# Altium project EVACC_v3_1.PrjPCB
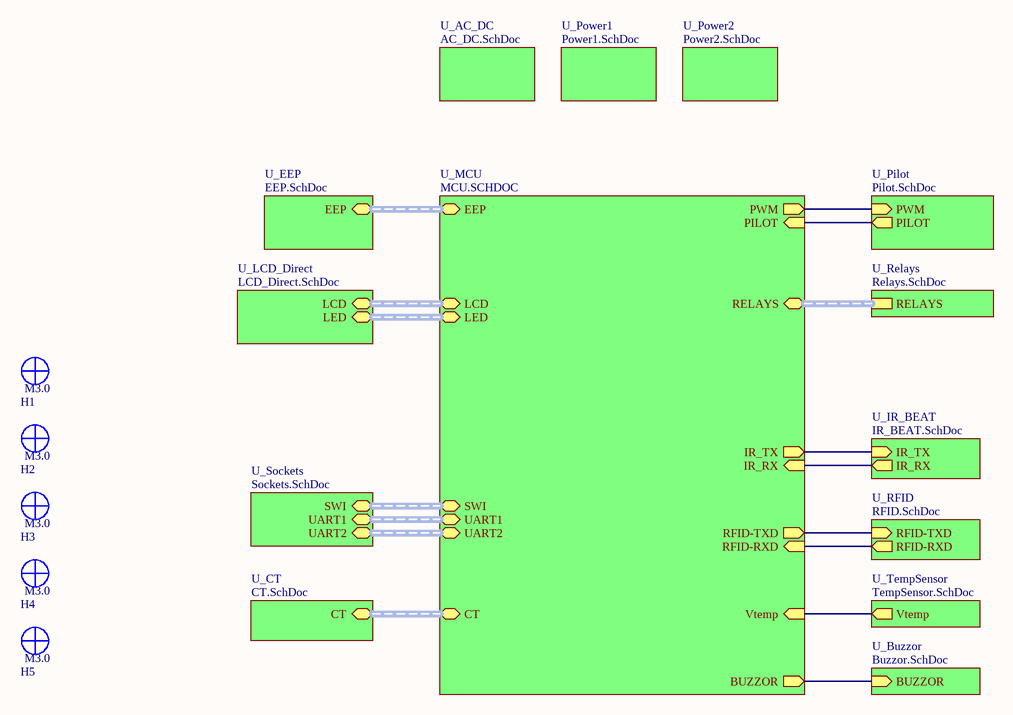
[diagram p0: layout.SchDoc]
15 sheets, 230 parts. Net scope: hierarchical (ports join the sheet entries above them; power ports are global).
Board file: evacc_v3_1.PcbDoc
Sheets:
  layout.SchDoc
    U_MCU = MCU.SCHDOC
    U_Pilot = Pilot.SchDoc
    U_EEP = EEP.SchDoc
    U_Sockets = Sockets.SchDoc
    U_TempSensor = TempSensor.SchDoc
    U_IR_BEAT = IR_BEAT.SchDoc
    U_RFID = RFID.SchDoc
    U_Buzzor = Buzzor.SchDoc
    U_CT = CT.SchDoc
    U_LCD_Direct = LCD_Direct.SchDoc
    U_Power1 = Power1.SchDoc
    U_Power2 = Power2.SchDoc
    U_AC_DC = AC_DC.SchDoc
    U_Relays = Relays.SchDoc

## Sheet layout.SchDoc
size A4

### Parts
H1  M3.0  [SCREW_HOLE_3.5]  (value not drawn)  (no BOM)
H2  M3.0  [SCREW_HOLE_3.5]  (value not drawn)  (no BOM)
H3  M3.0  [SCREW_HOLE_3.5]  (value not drawn)  (no BOM)
H4  M3.0  [SCREW_HOLE_3.5]  (value not drawn)  (no BOM)
H5  M3.0  [SCREW_HOLE_3.5]  (value not drawn)  (no BOM)

### Sub-sheets
U_AC_DC = AC_DC.SchDoc: no entries
U_Buzzor = Buzzor.SchDoc: BUZZOR (in)
U_CT = CT.SchDoc: CT (harness CT)
U_EEP = EEP.SchDoc: EEP (harness EEP)
U_IR_BEAT = IR_BEAT.SchDoc: IR_RX (out), IR_TX (in)
U_LCD_Direct = LCD_Direct.SchDoc: LCD (harness LCD), LED (harness LED)
U_MCU = MCU.SCHDOC: PWM (out), PILOT (in), Vtemp (in), IR_TX (out), RFID-TXD (out), IR_RX (in), RFID-RXD (in), BUZZOR (out), SWI (harness SWI), LCD (harness LCD), LED (harness LED), EEP (harness EEP), RELAYS (harness RELAYS), CT (harness CT), UART2 (harness UART2), UART1 (harness UART1)
U_Pilot = Pilot.SchDoc: PWM (in), PILOT (out)
U_Power1 = Power1.SchDoc: no entries
U_Power2 = Power2.SchDoc: no entries
U_Relays = Relays.SchDoc: RELAYS (harness RELAYS)
U_RFID = RFID.SchDoc: RFID-TXD (in), RFID-RXD (out)
U_Sockets = Sockets.SchDoc: SWI (harness SWI), UART2 (harness UART2), UART1 (harness UART1)
U_TempSensor = TempSensor.SchDoc: Vtemp (out)

### Nets
PILOT: sheet U_MCU/PILOT, sheet U_Pilot/PILOT
NetIR_PULSE_1: sheet U_MCU/IR_RX, sheet U_IR_BEAT/IR_RX
NetPWM_1: sheet U_MCU/PWM, sheet U_Pilot/PWM
NetR5_1: sheet U_MCU/RFID-TXD, sheet U_RFID/RFID-TXD
NetR36_1: sheet U_MCU/IR_TX, sheet U_IR_BEAT/IR_TX
NetR39_1: sheet U_MCU/Vtemp, sheet U_TempSensor/Vtemp
NetR40_2: sheet U_MCU/BUZZOR, sheet U_Buzzor/BUZZOR
NetU2_17: sheet U_MCU/RFID-RXD, sheet U_RFID/RFID-RXD

### Buses and harness runs
harness sheet U_CT/CT = sheet U_MCU/CT
harness sheet U_EEP/EEP = sheet U_MCU/EEP
harness sheet U_LCD_Direct/LCD = sheet U_MCU/LCD
harness sheet U_LCD_Direct/LED = sheet U_MCU/LED
harness sheet U_MCU/RELAYS = sheet U_Relays/RELAYS
harness sheet U_MCU/SWI = sheet U_Sockets/SWI
harness sheet U_MCU/UART1 = sheet U_Sockets/UART1
harness sheet U_MCU/UART2 = sheet U_Sockets/UART2

### Library data of the parts
H1-H5 = SCRE_HOLE_3.2: Screw hole for M3.0

## Sheet MCU.SCHDOC
size A4; SheetNumber: 2; SheetTotal: 6
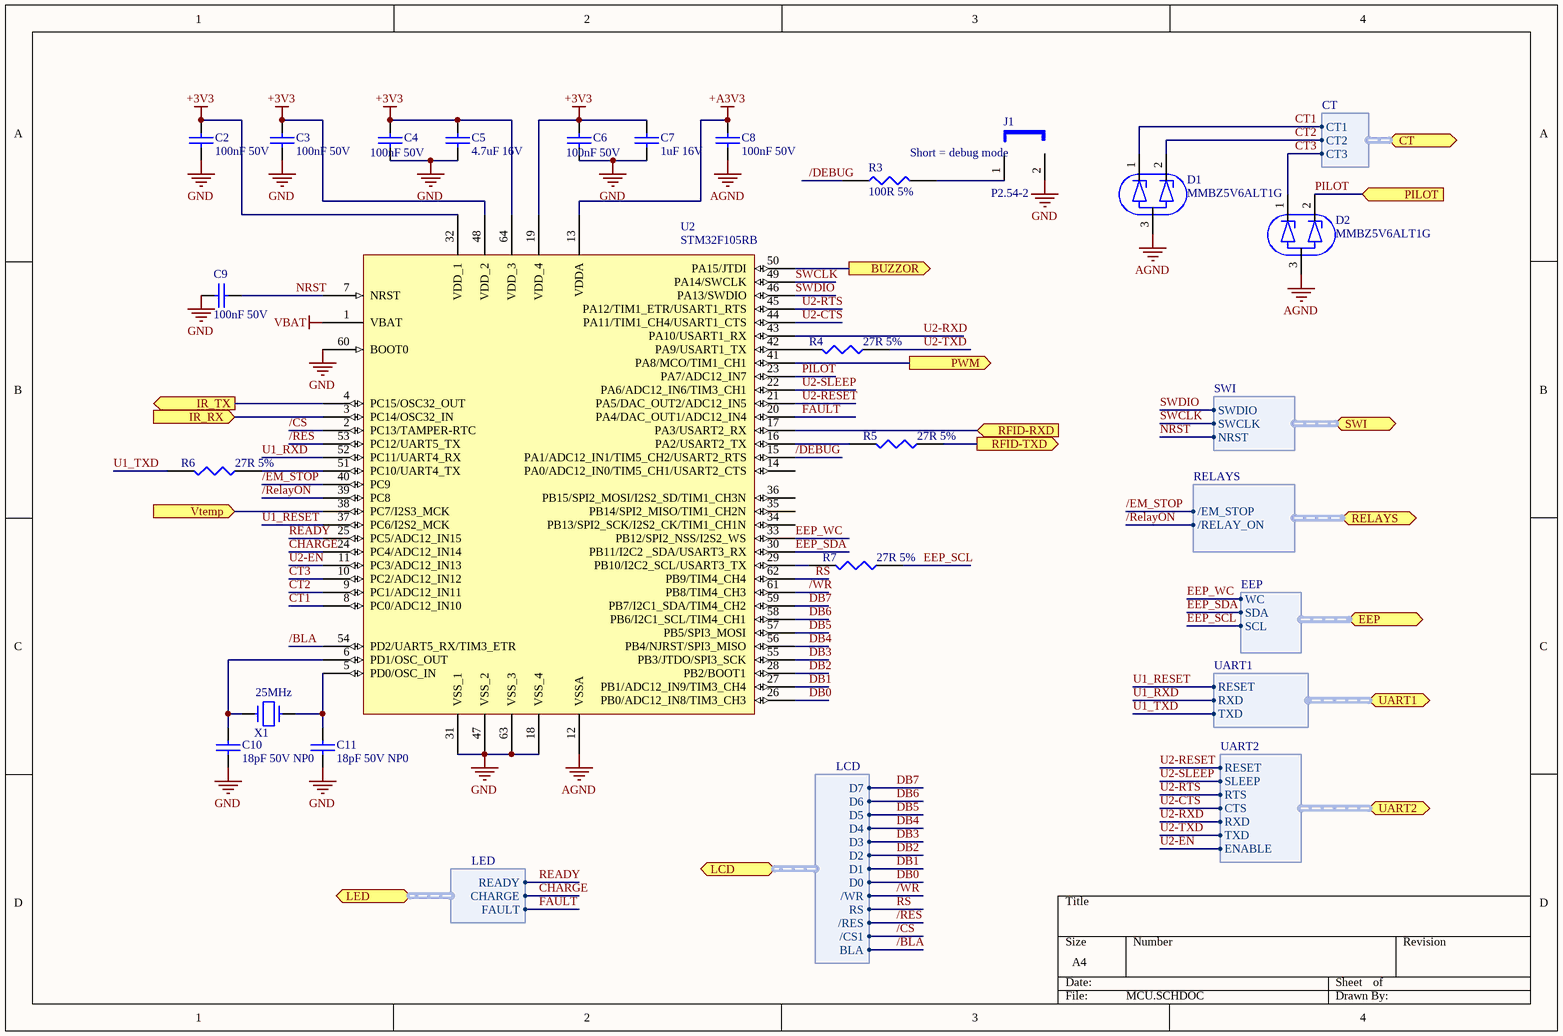
[diagram p1: MCU.SCHDOC]

### Parts
C2  100nF 50V  [CAPC2012N]
C3  100nF 50V  [CAPC2012N]
C4  100nF 50V  [CAPC2012N]
C5  4.7uF 16V  [CAPC2012N]
C6  100nF 50V  [CAPC2012N]
C7  1uF 16V  [CAPC2012N]
C8  100nF 50V  [CAPC2012N]
C9  100nF 50V  [CAPC2012N]
C10  18pF 50V NP0  [CAPC2012N]
C11  18pF 50V NP0  [CAPC2012N]
D1  MMBZ5V6ALT1G  [SOT23-3N]
D2  MMBZ5V6ALT1G  [SOT23-3N]
J1  P2.54-2  [JP2-P2.54]
R3  100R 5%  [RESC2012N]
R4  27R 5%  [RESC2012N]
R5  27R 5%  [RESC2012N]
R6  27R 5%  [RESC2012N]
R7  27R 5%  [RESC2012N]
U2  STM32F105RB  [TQFP64_M]
X1  25MHz  [ATSM-49]

### Ports
BUZZOR (out), CT (harness CT), EEP (harness EEP), IR_RX (in), IR_TX (out), LCD (harness LCD), LED (harness LED), PILOT (in), PWM (out), RELAYS (harness RELAYS), RFID-RXD (in), RFID-TXD (out), SWI (harness SWI), UART1 (harness UART1), UART2 (harness UART2), Vtemp (in)

### Harnesses
SWI: SWDIO, SWCLK, NRST
UART2: ENABLE, TXD, RXD, CTS, RTS, SLEEP, RESET
RELAYS: /EM_STOP, /RELAY_ON
LCD: D7, D6, D5, D4, D3, D2, D1, D0, /WR, RS, /RES, /CS1, BLA
LED: READY, CHARGE, FAULT
EEP: WC, SDA, SCL
CT: CT1, CT2, CT3
UART1: TXD, RXD, RESET

### Nets
+3V3: C2.1 C3.1 C4.1 C5.1 C6.1 C7.1 U2.19(VDD_4) U2.32(VDD_1) U2.48(VDD_2) U2.64(VDD_3)
+A3V3: C8.1 U2.13(VDDA)
AGND: C8.2 D1.3 D2.3 U2.12(VSSA)
GND: C2.2 C3.2 C4.2 C5.2 C6.2 C7.2 C9.2 C10.1 C11.1 J1.2 U2.18(VSS_4) U2.31(VSS_1) U2.47(VSS_2) U2.60(BOOT0) U2.63(VSS_3)
VBAT: U2.1(VBAT)
/BLA: U2.54(PD2/UART5_RX/TIM3_ETR) ; port LCD.BLA
/CS: U2.2(PC13/TAMPER-RTC) ; port LCD./CS1
/DEBUG: R3.1 U2.15(PA1/ADC12_IN1/TIM5_CH2/USART2_RTS)
/EM_STOP: U2.40(PC9) ; port RELAYS./EM_STOP
/RelayON: U2.39(PC8) ; port RELAYS./RELAY_ON
/RES: U2.53(PC12/UART5_TX) ; port LCD./RES
/WR: U2.61(PB8/TIM4_CH3) ; port LCD./WR
CHARGE: U2.24(PC4/ADC12_IN14) ; port LED.CHARGE
CT1: D1.1 U2.8(PC0/ADC12_IN10) ; port CT.CT1
CT2: D1.2 U2.9(PC1/ADC12_IN11) ; port CT.CT2
CT3: D2.1 U2.10(PC2/ADC12_IN12) ; port CT.CT3
DB0: U2.26(PB0/ADC12_IN8/TIM3_CH3) ; port LCD.D0
DB1: U2.27(PB1/ADC12_IN9/TIM3_CH4) ; port LCD.D1
DB2: U2.28(PB2/BOOT1) ; port LCD.D2
DB3: U2.55(PB3/JTDO/SPI3_SCK) ; port LCD.D3
DB4: U2.56(PB4/NJRST/SPI3_MISO) ; port LCD.D4
DB5: U2.57(PB5/SPI3_MOSI) ; port LCD.D5
DB6: U2.58(PB6/I2C1_SCL/TIM4_CH1) ; port LCD.D6
DB7: U2.59(PB7/I2C1_SDA/TIM4_CH2) ; port LCD.D7
EEP_SCL: R7.1 ; port EEP.SCL
EEP_SDA: U2.30(PB11/I2C2__SDA/USART3_RX) ; port EEP.SDA
EEP_WC: U2.33(PB12/SPI2_NSS/I2S2_WS) ; port EEP.WC
FAULT: U2.20(PA4/DAC_OUT1/ADC12_IN4) ; port LED.FAULT
NRST: C9.1 U2.7(NRST) ; port SWI.NRST
PILOT: D2.2 U2.23(PA7/ADC12_IN7) ; port PILOT
READY: U2.25(PC5/ADC12_IN15) ; port LED.READY
RS: U2.62(PB9/TIM4_CH4) ; port LCD.RS
SWCLK: U2.49(PA14/SWCLK) ; port SWI.SWCLK
SWDIO: U2.46(PA13/SWDIO) ; port SWI.SWDIO
U1_RESET: U2.37(PC6/I2S2_MCK) ; port UART1.RESET
U1_RXD: U2.52(PC11/UART4_RX) ; port UART1.RXD
U1_TXD: R6.2 ; port UART1.TXD
U2-CTS: U2.44(PA11/TIM1_CH4/USART1_CTS) ; port UART2.CTS
U2-EN: U2.11(PC3/ADC12_IN13) ; port UART2.ENABLE
U2-RESET: U2.21(PA5/DAC_OUT2/ADC12_IN5) ; port UART2.RESET
U2-RTS: U2.45(PA12/TIM1_ETR/USART1_RTS) ; port UART2.RTS
U2-RXD: U2.43(PA10/USART1_RX) ; port UART2.RXD
U2-SLEEP: U2.22(PA6/ADC12_IN6/TIM3_CH1) ; port UART2.SLEEP
U2-TXD: R4.1 ; port UART2.TXD
NetC10_2: C10.2 U2.6(PD1/OSC_OUT) X1.1
NetC11_2: C11.2 U2.5(PD0/OSC_IN) X1.2
NetIR_PULSE_1: U2.3(PC14/OSC32_IN) ; port IR_RX
NetJ1_1: J1.1 R3.2
NetPWM_1: U2.41(PA8/MCO/TIM1_CH1) ; port PWM
NetR4_2: R4.2 U2.42(PA9/USART1_TX)
NetR5_1: R5.1 ; port RFID-TXD
NetR5_2: R5.2 U2.16(PA2/USART2_TX)
NetR6_1: R6.1 U2.51(PC10/UART4_TX)
NetR7_2: R7.2 U2.29(PB10/I2C2_SCL/USART3_TX)
NetR36_1: U2.4(PC15/OSC32_OUT) ; port IR_TX
NetR39_1: U2.38(PC7/I2S3_MCK) ; port Vtemp
NetR40_2: U2.50(PA15/JTDI) ; port BUZZOR
NetU2_17: U2.17(PA3/USART2_RX) ; port RFID-RXD

Not connected (* = marked no-connect by the designer): U2 14(PA0/ADC12_IN0/TIM5_CH1/USART2_CTS) 34(PB13/SPI2_SCK/I2S2_CK/TIM1_CH1N) 35(PB14/SPI2_MISO/TIM1_CH2N) 36(PB15/SPI2_MOSI/I2S2_SD/TIM1_CH3N)

### Notes on the sheet
- (near J1) Short = debug mode

### Library data of the parts
C2-C9 = CAP: Capacitor
  C5: Price: 0.052
C10 C11 = CAP: Part Field 1: Capacitor; Part Field 3: Multilayer Ceramic; Part Field 4: SR15 Series
  C10: Part Field 2: 33pF/100V
  C11: Part Field 2: 47pF/100V
D1 D2 = PESD3V3S2UT: ESD protection diode 3.3V; Manufacturer: NXP; Price: 0.25
J1 = JUMPER: Jumper 2.54-2
R3 = RES1: Resistor; Price: 0.0025
R4-R7 = RES1
U2 = STM32F105XX: ST Cortex M3 MCU 64 pins
X1 = CRYSTAL: Price: *

## Sheet Pilot.SchDoc
size A4
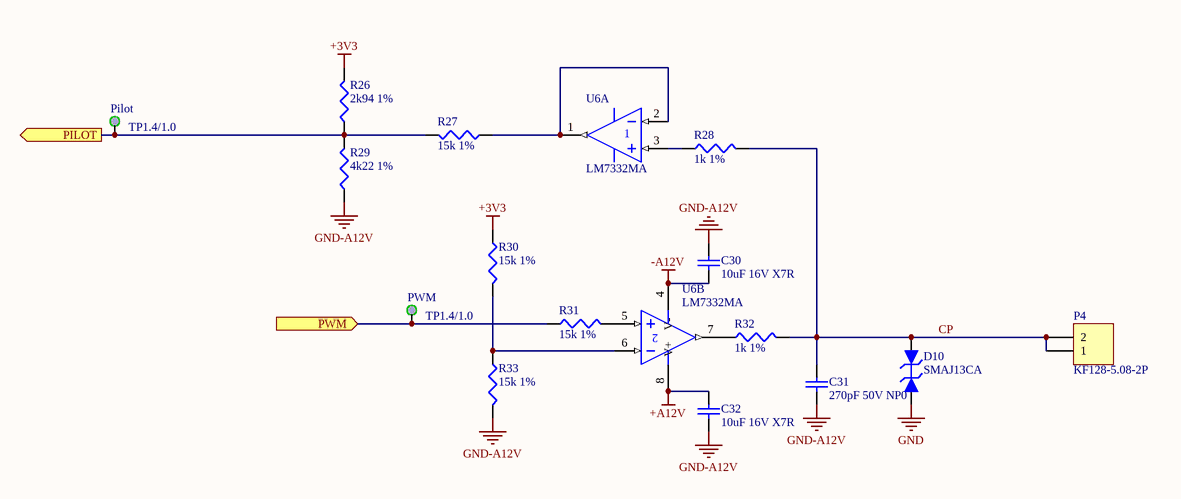
[diagram p2: Pilot.SchDoc]

### Parts
C30  10uF 16V X7R  [CAPC3216N]
C31  270pF 50V NP0  [CAPC2012N]
C32  10uF 16V X7R  [CAPC3216N]
D10  SMAJ13CA  [DSO-C2/G1.6]
P4  KF128-5.08-2P  [KF128-5.08-2P]
Pilot  TP1.4/1.0  [TP1.4/1.0]  (no BOM)
PWM  TP1.4/1.0  [TP1.4/1.0]  (no BOM)
R26  2k94 1%  [RESC2012N]
R27  15k 1%  [RESC2012N]
R28  1k 1%  [RESC2012N]
R29  4k22 1%  [RESC2012N]
R30  15k 1%  [RESC2012N]
R31  15k 1%  [RESC2012N]
R32  1k 1%  [RESC2012N]
R33  15k 1%  [RESC2012N]
U6  LM7332MA  [D008_M]  (parts A,B of 2)

### Ports
PILOT (out), PWM (in)

### Nets
+3V3: R26.2 R30.1
+A12V: C32.2 U6.8(V+)
-A12V: C30.1 U6.4(V-)
GND: D10.1
GND-A12V: C30.2 C31.1 C32.1 R29.1 R33.2
CP: C31.2 D10.2 P4.1 P4.2 R28.2 R32.2
PILOT: Pilot.1 R26.1 R27.2 R29.2 ; port PILOT
NetPWM_1: PWM.1 R31.1 ; port PWM
NetR27_1: R27.1 U6.1(OUT) U6.2(IN-)
NetR28_1: R28.1 U6.3(IN+)
NetR30_2: R30.2 R33.1 U6.6(IN-)
NetR31_2: R31.2 U6.5(IN+)
NetR32_1: R32.1 U6.7(OUT)

### Library data of the parts
C30 C32 = Cap Semi: Ceramic Capactor; Value: 100pF; Published: 8-Jun-2000; LatestRevisionDate: 29-May-2009; LatestRevisionNote: IPC-7351 Footprint Added.; PackageReference: C1206; Publisher: Altium Limited; PackageDescription: Chip Capacitor
C31 = Cap Semi: Capactor; Value: 100pF; Published: 8-Jun-2000; LatestRevisionDate: 29-May-2009; LatestRevisionNote: IPC-7351 Footprint Added.; PackageReference: C1206; Publisher: Altium Limited; PackageDescription: Chip Capacitor
D10 = Zener bidirectional: Bidirectional zener diode; Manufacturer: ON
P4 = Header 2: Connector 2-Pin; LatestRevisionDate: 17-Jul-2002; LatestRevisionNote: Re-released for DXP Platform.; Publisher: Altium Limited
R26-R33 = Res3: Resistor
U6 = LM258D: Dual Operational Amplifier; Manufacturer: TI; Published: 15-Apr-2002; LatestRevisionDate: 13-Apr-2006; LatestRevisionNote: IPC-7351 Footprint Added.; DatasheetVersion: Aug-1988; PackageVersion: Jan-1998; PackageReference: D008; Publisher: Altium Limited; PackageDescription: 8-Pin Small Outline Integrated Circuit 1.27 mm Pitch; Code_IPC: SOIC127P600-8; ComponentLink1Description: Manufacturer Link; ComponentLink1URL: http://www.ti.com/; ComponentLink2Description: Datasheet; ComponentLink2URL: http://www-s.ti.com/sc/ds/lm258.pdf; Price: *

## Sheet EEP.SchDoc
size A4
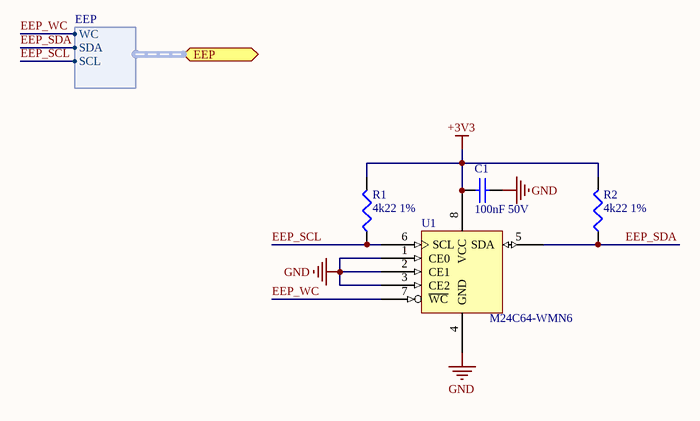
[diagram p3: EEP.SchDoc]

### Parts
C1  100nF 50V  [CAPC2012N]
R1  4k22 1%  [RESC2012N]
R2  4k22 1%  [RESC2012N]
U1  M24C64-WMN6  [SO8_M]

### Ports
EEP (harness EEP)

### Harnesses
EEP: WC, SDA, SCL

### Nets
+3V3: C1.1 R1.2 R2.2 U1.8(VCC)  [also labelled VCC]
GND: C1.2 U1.1(CE0) U1.2(CE1) U1.3(CE2) U1.4(GND)
EEP_SCL: R1.1 U1.6(SCL) ; port EEP.SCL
EEP_SDA: R2.1 U1.5(SDA) ; port EEP.SDA
EEP_WC: U1.7(~{WC}) ; port EEP.WC

### Library data of the parts
C1 = CAP: Capacitor
R1 R2 = Res3: Resistor; Published: 8-Jun-2000; LatestRevisionDate: 04-Mar-2005; LatestRevisionNote: PCB Footprint replaced.; PackageReference: J1-0603; Publisher: Altium Limited
U1 = ST24E64B6(8): Serial Extended Addressing Compatible With I2C Bus 64K(8K x 8) EEPROM; Manufacturer: ST; Price: 0.85

## Sheet Sockets.SchDoc
size A4
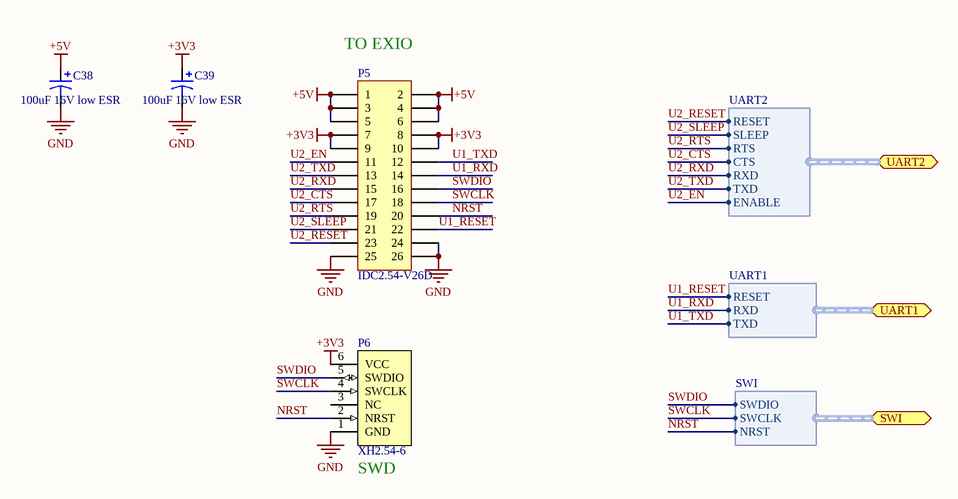
[diagram p4: Sockets.SchDoc]

### Parts
C38  100uF 16V low ESR  [CAPPR2-5x11]
C39  100uF 16V low ESR  [CAPPR2-5x11]
P5  IDC2.54-V26D  [IDC2.54-V26D]
P6  XH2.54-6  [REAL_SIP6_2.54]

### Ports
SWI (harness SWI), UART1 (harness UART1), UART2 (harness UART2)

### Harnesses
SWI: SWDIO, SWCLK, NRST
UART2: ENABLE, TXD, RXD, CTS, RTS, SLEEP, RESET
UART1: TXD, RXD, RESET

### Nets
+3V3: C39.1 P5.7 P5.8 P5.9 P5.10 P6.6(VCC)
+5V: C38.1 P5.1 P5.2 P5.3 P5.4 P5.5 P5.6
GND: C38.2 C39.2 P5.24 P5.25 P5.26 P6.1(GND)
NRST: P5.20 P6.2(NRST) ; port SWI.NRST
SWCLK: P5.18 P6.4(SWCLK) ; port SWI.SWCLK
SWDIO: P5.16 P6.5(SWDIO) ; port SWI.SWDIO
U1_RESET: P5.22 ; port UART1.RESET
U1_RXD: P5.14 ; port UART1.RXD
U1_TXD: P5.12 ; port UART1.TXD
U2_CTS: P5.17 ; port UART2.CTS  [project net U2-CTS]
U2_EN: P5.11 ; port UART2.ENABLE  [project net U2-EN]
U2_RESET: P5.23 ; port UART2.RESET  [project net U2-RESET]
U2_RTS: P5.19 ; port UART2.RTS  [project net U2-RTS]
U2_RXD: P5.15 ; port UART2.RXD  [project net U2-RXD]
U2_SLEEP: P5.21 ; port UART2.SLEEP  [project net U2-SLEEP]
U2_TXD: P5.13 ; port UART2.TXD  [project net U2-TXD]

Not connected (* = marked no-connect by the designer): P6 3(NC)

### Notes on the sheet
- (near P5) TO EXIO
- (near P6) SWD

### Library data of the parts
C38 C39 = Cap Pol1: Polarized Capacitor (Radial); Price: 0.38
P5 = Header 13X2: IDC2.54-13x2 Header; LatestRevisionDate: 17-Jul-2002; LatestRevisionNote: Re-released for DXP Platform.; Publisher: Altium Limited; Price: 0.38
P6 = SWD-Connector: SW debug connector

## Sheet TempSensor.SchDoc
size A4
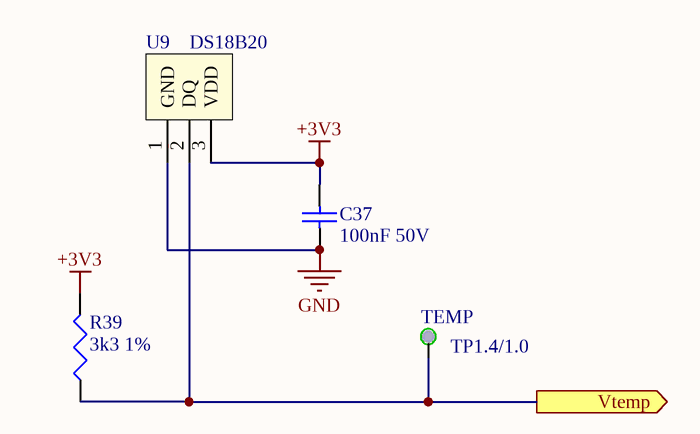
[diagram p5: TempSensor.SchDoc]

### Parts
C37  100nF 50V  [CAPC2012N]
R39  3k3 1%  [RESC2012N]
TEMP  TP1.4/1.0  [TP1.4/1.0]  (no BOM)
U9  DS18B20  [TO92 variant]

### Ports
Vtemp (out)

### Nets
+3V3: C37.2 R39.2 U9.3(VDD)
GND: C37.1 U9.1(GND)
NetR39_1: R39.1 TEMP.1 U9.2(DQ) ; port Vtemp

### Library data of the parts
C37 = Cap Semi: Capacitor; Value: 100pF; Published: 8-Jun-2000; LatestRevisionDate: 29-May-2009; LatestRevisionNote: IPC-7351 Footprint Added.; PackageReference: C1206; Publisher: Altium Limited; PackageDescription: Chip Capacitor
R39 = Res3: Resistor; Value: 1K; Published: 8-Jun-2000; LatestRevisionDate: 29-May-2009; LatestRevisionNote: IPC-7351 Footprint Added.; PackageReference: J1-0603; Publisher: Altium Limited; PackageDescription: Chip Resistor
U9 = DS18B20: Digital Temperature sensor; Manufacturer: Maxim; Price: *

## Sheet IR_BEAT.SchDoc
size A4
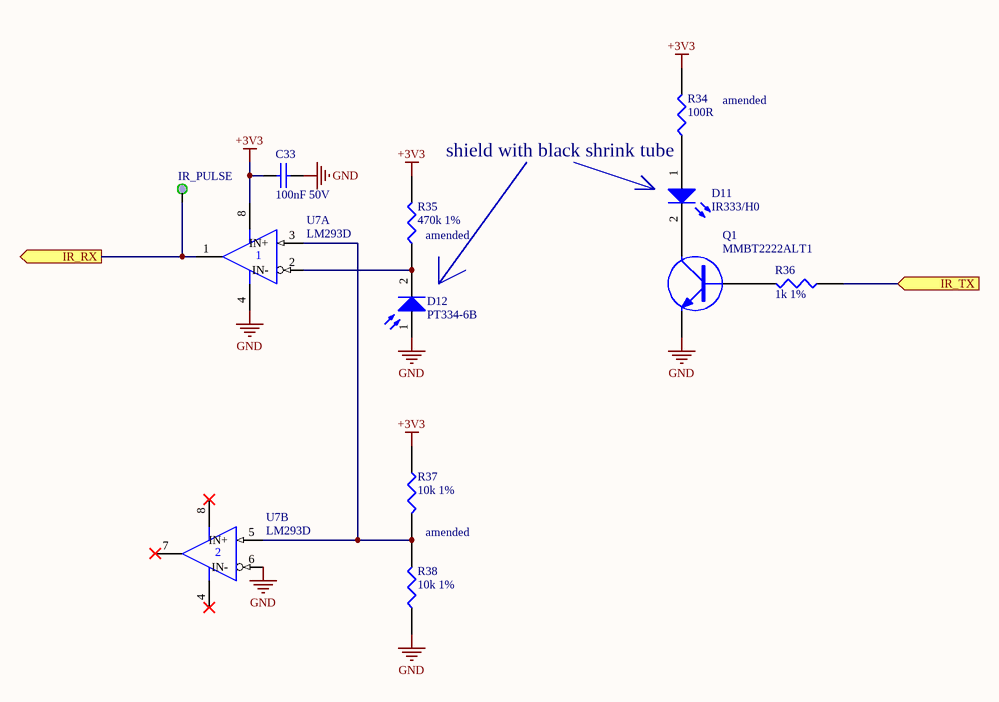
[diagram p6: IR_BEAT.SchDoc]

### Parts
C33  100nF 50V  [CAPC2012N]
D11  IR333/H0  [LED5.08/2.54-2]
D12  PT334-6B  [LED5.08/2.54-2]
IR_PULSE  IR PULSE  [TP1.4/1.0]  (value not drawn)  (no BOM)
Q1  MMBT2222ALT1  [SOT23-3N]
R34  100R  [RESC2012N]
R35  470k 1%  [RESC2012N]
R36  1k 1%  [RESC2012N]
R37  10k 1%  [RESC2012N]
R38  10k 1%  [RESC2012N]
U7  LM293D  [SOP8_M]  (parts A,B of 2)

### Ports
IR_RX (out), IR_TX (in)

### Nets
+3V3: C33.2 R34.2 R35.2 R37.1 U7.8(VCC)
GND: C33.1 D12.1(A) Q1.2(E) R38.1 U7.4(GND) U7.6(IN-)
NetD11_1: D11.1(A) R34.1
NetD11_2: D11.2(K) Q1.3(C)
NetD12_2: D12.2(K) R35.1 U7.2(IN-)
NetIR_PULSE_1: IR_PULSE.1 U7.1(OUT) ; port IR_RX
NetQ1_1: Q1.1(B) R36.2
NetR36_1: R36.1 ; port IR_TX
NetR37_2: R37.2 R38.2 U7.3(IN+) U7.5(IN+)

Not connected (* = marked no-connect by the designer): U7 7(OUT)*

### Notes on the sheet
- (near R34) amended
- (near R34) shield with black shrink tube
- (near R35) amended
- amended

### Library data of the parts
C33 = CAP: Capacitor; Price: 0.025
D11 = LED0: Typical INFRARED GaAs LED; Manufacturer: Everlight; Price: *
D12 = Photo Sen: Photosensitive Diode; Manufacturer: Everlight; Price: *
IR_PULSE = TP1.4/1.0
Q1 = MMBT3904: NPN transistor; Price: 0.25
R34-R38 = RES1: Price: 0.0025
U7 = LM393D: Dual Differential Comparator; Published: 15-Apr-2002; LatestRevisionDate: 13-Apr-2006; LatestRevisionNote: IPC-7351 Footprint Added.; DatasheetVersion: Nov-1988; PackageVersion: Jan-1998; PackageReference: D008; Publisher: Altium Limited; PackageDescription: 8-Pin Small Outline Integrated Circuit 1.27 mm Pitch; Code_IPC: SOIC127P600-8; ComponentLink1Description: Manufacturer Link; ComponentLink1URL: http://www.ti.com/; ComponentLink2Description: Datasheet; ComponentLink2URL: http://www-s.ti.com/sc/ds/lm193.pdf; Price: 0.8

## Sheet RFID.SchDoc: RFID interface
size A4
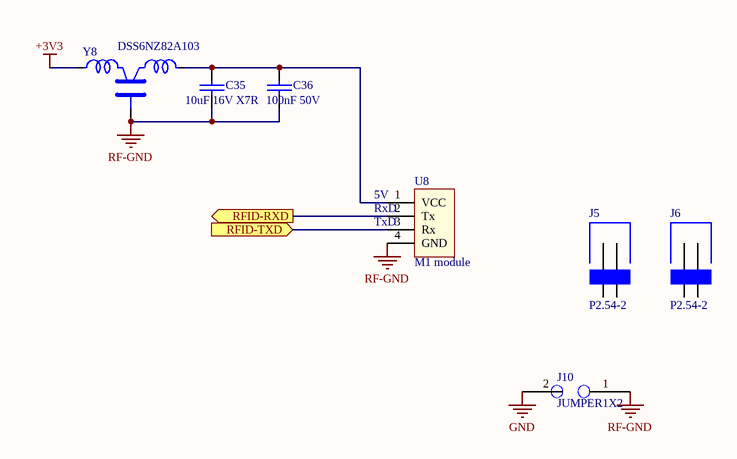
[diagram p7: RFID.SchDoc]

### Parts
C35  10uF 16V X7R  [CAPC3216N]
C36  100nF 50V  [CAPC2012N]
J5  P2.54-2  [JP2-P2.54]
J6  P2.54-2  [JP2-P2.54]
J10  JUMPER1X2  [JP-SOLDER-H1X2-3X2]  (no BOM)
U8  M1 module  [RFID_MOD]
Y8  DSS6NZ82A103  [DSS6]

### Ports
RFID-RXD (out), RFID-TXD (in)

### Nets
+3V3: Y8.1
GND: J10.2
RF-GND: C35.2 C36.2 J10.1 U8.4(GND) Y8.2
NetC35_1: C35.1 C36.1 U8.1(VCC) Y8.3
NetR5_1: U8.3(Rx) ; port RFID-TXD
NetU2_17: U8.2(Tx) ; port RFID-RXD

Not connected (* = marked no-connect by the designer): J5 1 2; J6 1 2

### Notes on the sheet
- (near U8) TxD
- (near U8) RxD
- (near U8) 5V

### Library data of the parts
C35 C36 = CAP: Price: 0.025
J5 J6 = JP2-2.54
U8 = RFID-M1: RFID module
Y8 = DSS6: Murata EMI suppression filter; Manufacturer: Murata; Price: 0.5

## Sheet Buzzor.SchDoc
size A4
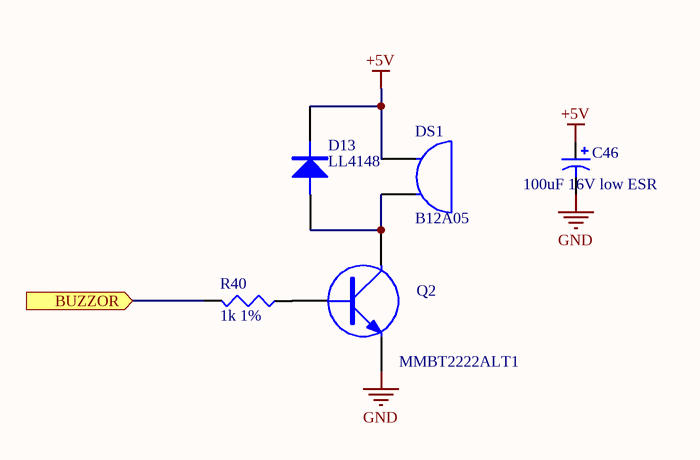
[diagram p8: Buzzor.SchDoc]

### Parts
C46  100uF 16V low ESR  [CAPPR2-5x11]
D13  LL4148  [MELF-D3513-1405]
DS1  B12A05  [BZ12/10mm]
Q2  MMBT2222ALT1  [SOT23-3N]
R40  1k 1%  [RESC2012N]

### Ports
BUZZOR (in)

### Nets
+5V: C46.1 D13.2(K) DS1.1(A)
GND: C46.2 Q2.2(E)
NetD13_1: D13.1(A) DS1.2(B) Q2.3(C)
NetQ2_1: Q2.1(B) R40.1
NetR40_2: R40.2 ; port BUZZOR

### Library data of the parts
C46 = Cap Pol1: Polarized Capacitor (Radial); Price: 0.38
D13 = DIODE
DS1 = BUZZER: HXD 5VDC dia12 h10; Price: 1.3
Q2 = NPN: NPN transistor; Price: 0.25
R40 = Res3: Resistor

## Sheet CT.SchDoc
size A4
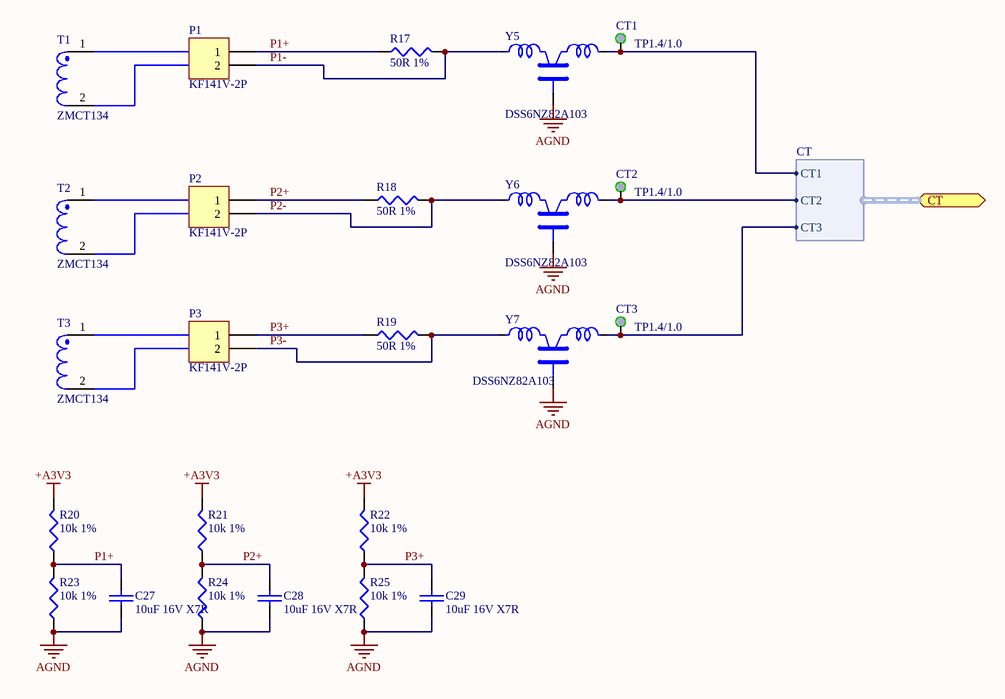
[diagram p9: CT.SchDoc]

### Parts
C27  10uF 16V X7R  [CAPC3216N]
C28  10uF 16V X7R  [CAPC3216N]
C29  10uF 16V X7R  [CAPC3216N]
CT1  TP1.4/1.0  [TP1.4/1.0]  (no BOM)
CT2  TP1.4/1.0  [TP1.4/1.0]  (no BOM)
CT3  TP1.4/1.0  [TP1.4/1.0]  (no BOM)
P1  KF141V-2P  [KF141V-2P]
P2  KF141V-2P  [KF141V-2P]
P3  KF141V-2P  [KF141V-2P]
R17  50R 1%  [RESC2012N]
R18  50R 1%  [RESC2012N]
R19  50R 1%  [RESC2012N]
R20  10k 1%  [RESC2012N]
R21  10k 1%  [RESC2012N]
R22  10k 1%  [RESC2012N]
R23  10k 1%  [RESC2012N]
R24  10k 1%  [RESC2012N]
R25  10k 1%  [RESC2012N]
T1  ZMCT134  (mechanical)
T2  ZMCT134  (mechanical)
T3  ZMCT134  (mechanical)
Y5  DSS6NZ82A103  [DSS6]
Y6  DSS6NZ82A103  [DSS6]
Y7  DSS6NZ82A103  [DSS6]

### Ports
CT (harness CT)

### Harnesses
CT: CT1, CT2, CT3

### Nets
+A3V3: R20.2 R21.2 R22.2
AGND: C27.1 C28.1 C29.1 R23.1 R24.1 R25.1 Y5.2 Y6.2 Y7.2
CT1: CT1.1 Y5.3 ; port CT.CT1
CT2: CT2.1 Y6.3 ; port CT.CT2
CT3: CT3.1 Y7.3 ; port CT.CT3
P1+: C27.2 P1.1 R17.1 R20.1 R23.2
P1-: P1.2 R17.2 Y5.1
P2+: C28.2 P2.1 R18.1 R21.1 R24.2
P2-: P2.2 R18.2 Y6.1
P3+: C29.2 P3.1 R19.1 R22.1 R25.2
P3-: P3.2 R19.2 Y7.1

Not connected (* = marked no-connect by the designer): T1 1 2; T2 1 2; T3 1 2

### Library data of the parts
C27-C29 = CAP: Price: 0.025
P1-P3 = Header 2: CT connector; LatestRevisionDate: 17-Jul-2002; LatestRevisionNote: Re-released for DXP Platform.; Publisher: Altium Limited
R17-R25 = Res3: Resistor; Value: 1K; Published: 8-Jun-2000; LatestRevisionDate: 29-May-2009; LatestRevisionNote: IPC-7351 Footprint Added.; PackageReference: J1-0603; Publisher: Altium Limited; PackageDescription: Chip Resistor
T1-T3 = CURRENT_TRANS: Current transformer
Y5-Y7 = DSS6: Murata EMI suppression filter; Manufacturer: Murata; Price: 0.5

## Sheet LCD_Direct.SchDoc
size A4
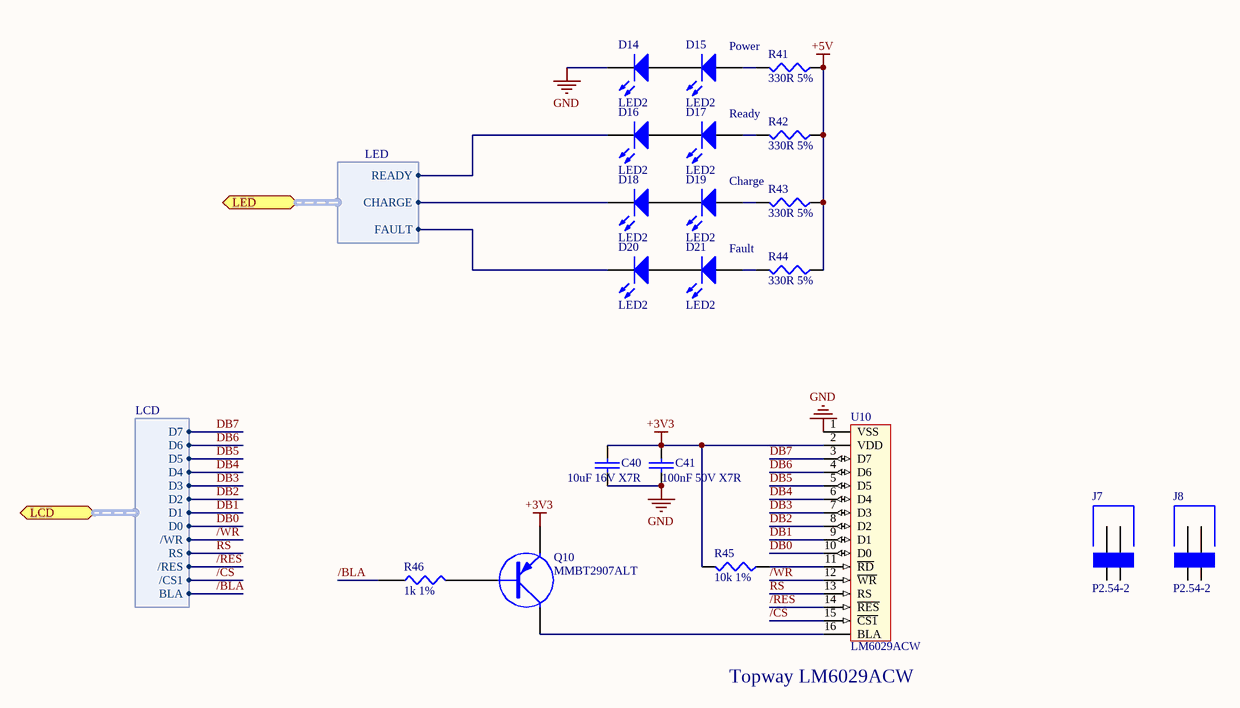
[diagram p10: LCD_Direct.SchDoc]

### Parts
C40  10uF 16V X7R  [CAPC3216N]
C41  100nF 50V X7R  [CAPC2012N]
D14  LED2  [3.2X1.6X1.1]
D15  LED2  [3.2X1.6X1.1]
D16  LED2  [3.2X1.6X1.1]
D17  LED2  [3.2X1.6X1.1]
D18  LED2  [3.2X1.6X1.1]
D19  LED2  [3.2X1.6X1.1]
D20  LED2  [3.2X1.6X1.1]
D21  LED2  [3.2X1.6X1.1]
J7  P2.54-2  [JP2-P2.54]
J8  P2.54-2  [JP2-P2.54]
Q10  MMBT2907ALT  [SOT23-3N]
R41  330R 5%  [RESC2012N]
R42  330R 5%  [RESC2012N]
R43  330R 5%  [RESC2012N]
R44  330R 5%  [RESC2012N]
R45  10k 1%  [RESC2012N]
R46  1k 1%  [RESC2012N]
U10  LM6029ACW  [LM6029A]

### Ports
LCD (harness LCD), LED (harness LED)

### Harnesses
LCD: D7, D6, D5, D4, D3, D2, D1, D0, /WR, RS, /RES, /CS1, BLA
LED: READY, CHARGE, FAULT

### Nets
+3V3: C40.1 C41.1 Q10.2(E) R45.2 U10.2(VDD)
+5V: R41.1 R42.1 R43.1 R44.1
GND: C40.2 C41.2 D14.2(K) U10.1(VSS)
/BLA: R46.1 ; port LCD.BLA
/CS: U10.15(~{CS1}) ; port LCD./CS1
/RES: U10.14(~{RES}) ; port LCD./RES
/WR: U10.12(~{WR}) ; port LCD./WR
CHARGE: D18.2(K) ; port LED.CHARGE
DB0: U10.10(D0) ; port LCD.D0
DB1: U10.9(D1) ; port LCD.D1
DB2: U10.8(D2) ; port LCD.D2
DB3: U10.7(D3) ; port LCD.D3
DB4: U10.6(D4) ; port LCD.D4
DB5: U10.5(D5) ; port LCD.D5
DB6: U10.4(D6) ; port LCD.D6
DB7: U10.3(D7) ; port LCD.D7
FAULT: D20.2(K) ; port LED.FAULT
READY: D16.2(K) ; port LED.READY
RS: U10.13(RS) ; port LCD.RS
NetD14_1: D14.1(A) D15.2(K)
NetD15_1: D15.1(A) R41.2
NetD16_1: D16.1(A) D17.2(K)
NetD17_1: D17.1(A) R42.2
NetD18_1: D18.1(A) D19.2(K)
NetD19_1: D19.1(A) R43.2
NetD20_1: D20.1(A) D21.2(K)
NetD21_1: D21.1(A) R44.2
NetQ10_1: Q10.1(B) R46.2
NetQ10_3: Q10.3(C) U10.16(BLA)
NetR45_1: R45.1 U10.11(~{RD})

Not connected (* = marked no-connect by the designer): J7 1 2; J8 1 2

### Notes on the sheet
- Power
- Ready
- Charge
- Fault
- (near U10) Topway LM6029ACW

### Library data of the parts
C40 = CAP: Price: 0.025
C41 = CAP: Capacitor
D14-D21 = LED2: Typical RED, GREEN, YELLOW, AMBER GaAs LED; Published: 8-Jun-2000; LatestRevisionDate: 17-Jul-2002; LatestRevisionNote: Re-released for DXP Platform.; PackageDocument: Feb-2002; PackageReference: 3.2X1.6X1.1; Publisher: Altium Limited
J7 J8 = JP2-2.54
Q10 = MMBT3906: PNP transitor; Price: 0.25
R41-R45 = Res3: Resistor
  R45: Published: 8-Jun-2000; LatestRevisionDate: 04-Mar-2005; LatestRevisionNote: PCB Footprint replaced.; PackageReference: J1-0603; Publisher: Altium Limited
R46 = RES1: Price: 0.0025
U10 = LM6029A: Topway LCD module 3.3V; Price: 35

## Sheet Power1.SchDoc
size A4
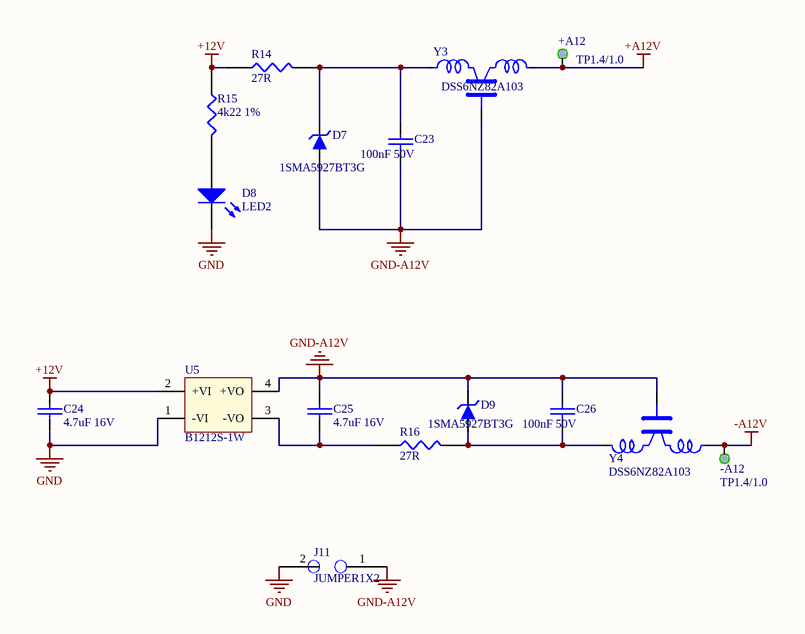
[diagram p11: Power1.SchDoc]

### Parts
+A12  TP1.4/1.0  [TP1.4/1.0]  (no BOM)
-A12  TP1.4/1.0  [TP1.4/1.0]  (no BOM)
C23  100nF 50V  [CAPC2012N]
C24  4.7uF 16V  [CAPC2012N]
C25  4.7uF 16V  [CAPC2012N]
C26  100nF 50V  [CAPC2012N]
D7  1SMA5927BT3G  [DSO-C2/X1.8]
D8  LED2  [3.2X1.6X1.1]
D9  1SMA5927BT3G  [DSO-C2/X1.8]
J11  JUMPER1X2  [JP-SOLDER-H1X2-3X2]  (no BOM)
R14  27R  [RESC3216N]
R15  4k22 1%  [RESC2012N]
R16  27R  [RESC3216N]
U5  B1212S-1W  [B0505S-W1]
Y3  DSS6NZ82A103  [DSS6]
Y4  DSS6NZ82A103  [DSS6]

### Nets
+12V: C24.1 R14.1 R15.1 U5.2(+VI)
+A12V: +A12.1 Y3.3
-A12V: -A12.1 Y4.1
GND: C24.2 D8.2(K) J11.2 U5.1(-VI)
GND-A12V: C23.1 C25.1 C26.2 D7.1(A) D9.2(K) J11.1 U5.4(+VO) Y3.2 Y4.2
NetC23_2: C23.2 D7.2(K) R14.2 Y3.1
NetC25_2: C25.2 R16.1 U5.3(-VO)
NetC26_1: C26.1 D9.1(A) R16.2 Y4.3
NetD8_1: D8.1(A) R15.2

### Library data of the parts
C23 C26 = CAP: Price: 0.025
C24 C25 = CAP: Capacitor; Price: 0.025
D7 D9 = Zener unidirectional: Zener diode; Manufacturer: ON; Price: 2.5
D8 = LED2: as D14 on sheet LCD_Direct; Published: 8-Jun-2000; LatestRevisionDate: 17-Jul-2002; LatestRevisionNote: Re-released for DXP Platform.; PackageDocument: Feb-2002; PackageReference: 3.2X1.6X1.1; Publisher: Altium Limited
R14-R16 = RES1
U5 = B0505S-1W: 12V isolated DC-DC converter; Price: 4.5
Y3 Y4 = DSS6: Murata EMI suppression filter; Manufacturer: Murata; Price: 0.5

## Sheet Power2.SchDoc
size A4
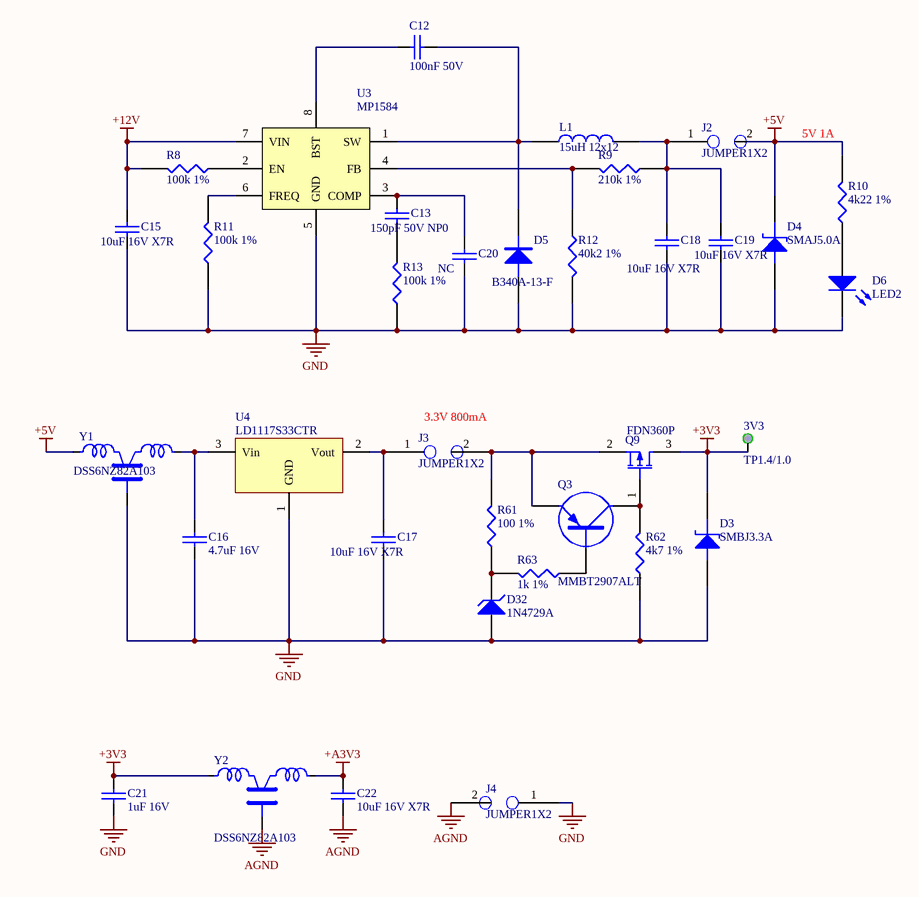
[diagram p12: Power2.SchDoc]

### Parts
3V3  TP1.4/1.0  [TP1.4/1.0]  (no BOM)
C12  100nF 50V  [CAPC2012N]
C13  150pF 50V NP0  [CAPC2012N]
C15  10uF 16V X7R  [CAPC3216N]
C16  4.7uF 16V  [CAPC2012N]
C17  10uF 16V X7R  [CAPC3216N]
C18  10uF 16V X7R  [CAPC3216N]
C19  10uF 16V X7R  [CAPC3216N]
C20  NC  [CAPC2012N]  (no BOM)
C21  1uF 16V  [CAPC2012N]
C22  10uF 16V X7R  [CAPC3216N]
D3  SMBJ3.3A  [DSO-C2/X2.3]
D4  SMAJ5.0A  [DSO-C2/G1.6]
D5  B340A-13-F  [DSO-C2/G1.6]
D6  LED2  [3.2X1.6X1.1]
D32  1N4729A  [DIO10.36-5.2x2.8]
J2  JUMPER1X2  [JP-SOLDER-H1X2-3X2]  (no BOM)
J3  JUMPER1X2  [JP-SOLDER-H1X2-3X2]  (no BOM)
J4  JUMPER1X2  [JP-SOLDER-H1X2-3X2]  (no BOM)
L1  15uH 12x12  [IN-12.2X12.2MM]
Q3  MMBT2907ALT  [SOT23-3N]
Q9  FDN360P  [SOT23-3N]
R8  100k 1%  [RESC2012N]
R9  210k 1%  [RESC2012N]
R10  4k22 1%  [RESC2012N]
R11  100k 1%  [RESC2012N]
R12  40k2 1%  [RESC2012N]
R13  100k 1%  [RESC2012N]
R61  100 1%  [RESC2012N]
R62  4k7 1%  [RESC2012N]
R63  1k 1%  [RESC2012N]
U3  MP1584  [SOIC8E]
U4  LD1117S33CTR  [SOT223-4M]
Y1  DSS6NZ82A103  [DSS6]
Y2  DSS6NZ82A103  [DSS6]

### Nets
+3V3: 3V3.1 C21.1 D3.2(K) Q9.3(D) Y2.1
+5V: D4.2(K) J2.2 R10.2 Y1.1
+12V: C15.1 R8.2 U3.7(VIN)
+A3V3: C22.1 Y2.3
AGND: C22.2 J4.2 Y2.2
GND: C15.2 C16.2 C17.2 C18.2 C19.2 C20.2 C21.2 D3.1(A) D4.1(A) D5.1(A) D6.2(K) D32.1(A) J4.1 R11.1 R12.2 R13.1 R62.1 U3.5(GND) U4.1(GND) Y1.2
NetC12_1: C12.1 U3.8(BST)
NetC12_2: C12.2 D5.2(K) L1.1 U3.1(SW)
NetC13_1: C13.1 C20.1 U3.3(COMP)
NetC13_2: C13.2 R13.2
NetC16_1: C16.1 U4.3(Vin) Y1.3
NetC17_1: C17.1 J3.1 U4.2(Vout)
NetC18_1: C18.1 C19.1 J2.1 L1.2 R9.1
NetD6_1: D6.1(A) R10.1
NetD32_2: D32.2(K) R61.1 R63.2
NetJ3_2: J3.2 Q3.2(E) Q9.2(S) R61.2
NetQ3_1: Q3.1(B) R63.1
NetQ3_3: Q3.3(C) Q9.1(G) R62.2
NetR8_1: R8.1 U3.2(EN)
NetR9_2: R9.2 R12.1 U3.4(FB)
NetR11_2: R11.2 U3.6(FREQ)

### Notes on the sheet
- (near R10) 5V 1A
- (near J3) 3.3V 800mA

### Library data of the parts
C12 C13 C17-C20 = CAP: Price: 0.025
C15 C16 C21 C22 = CAP: Capacitor; Price: 0.025
D3 D4 = ZENER2: Zener Diode; Manufacturer: Vishay; Price: 0.65
D5 = DIODE: Zener Diode 3A 40V; Price: 0.4
D6 = LED2: as D14 on sheet LCD_Direct; Published: 8-Jun-2000; LatestRevisionDate: 17-Jul-2002; LatestRevisionNote: Re-released for DXP Platform.; PackageDocument: Feb-2002; PackageReference: 3.2X1.6X1.1; Publisher: Altium Limited
D32 = D Zener: Zener Diode; Published: 8-Jun-2000; LatestRevisionDate: 17-Jul-2002; LatestRevisionNote: Re-released for DXP Platform.; PackageReference: DIODE-0.7; Publisher: Altium Limited
L1 = INDUCTOR: Inductor 3A
Q3 = MMBT3906: PNP transitor; Price: 0.25
Q9 = MOSFET-P: P-Channel MOSFET; PackageDocument: 1995/1996; Published: 8-Jun-2000; LatestRevisionDate: 17-Jul-2002; LatestRevisionNote: Re-released for DXP Platform.; PackageReference: E3; Publisher: Altium Limited
R8-R13 R61-R63 = RES1
U3 = MP1584: 3A 1.5MHz, 28V step down converter; Manufacturer: MSP; Price: *
U4 = VOLTREG: ST Low drop voltage regulator; Price: 1.5; Manufacturer: ST
Y1 Y2 = DSS6: Murata EMI suppression filter; Manufacturer: Murata; Price: 0.5

## Sheet AC_DC.SchDoc
size A4
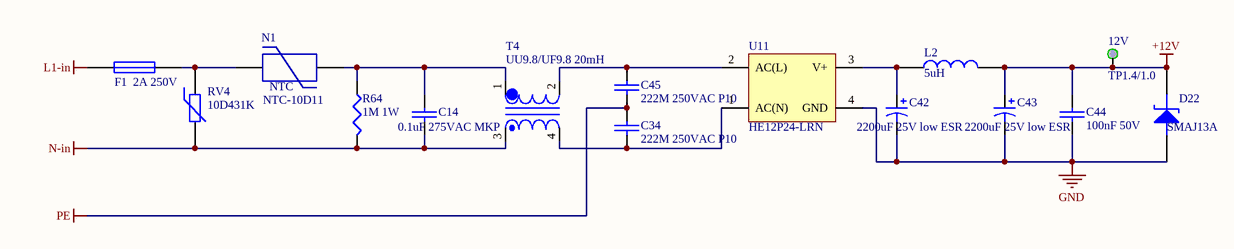
[diagram p13: AC_DC.SchDoc]

### Parts
12V  TP1.4/1.0  [TP1.4/1.0]  (no BOM)
C14  0.1uF 275VAC MKP  [0.1uF 275VAC MKP]
C34  222M 250VAC P10  [CAPRD10-9x5]
C42  2200uF 25V low ESR  [CAPPR7.5-16x25]
C43  2200uF 25V low ESR  [CAPPR7.5-16x25]
C44  100nF 50V  [CAPC2012N]
C45  222M 250VAC P10  [CAPRD10-9x5]
D22  SMAJ13A  [DSO-C2/G1.6]
F1  2A 250V  [FUSE-CASE-23mm]
L2  5uH  [Inductor9.5-11x21]
N1  NTC-10D11  [10D431K]
R64  1M 1W  [RES15-13.5X5]
RV4  10D431K  [10D431K]
T4  UU9.8/UF9.8 20mH  [UU9.8/UF9.8]
U11  HE12P24-LRN  [HIECUBE_AC_DC_24W]

### Nets
+12V: 12V.1 C43.1 C44.2 D22.2(K) L2.2
GND: C42.2 C43.2 C44.1 D22.1(A) U11.4(GND)
L1-in: F1.1
N-in: C14.1 R64.2 RV4.2 T4.3
PE: C34.2 C45.1
NetC14_2: C14.2 N1.2 R64.1 T4.1
NetC34_1: C34.1 T4.4 U11.1(AC(N))
NetC42_1: C42.1 L2.1 U11.3(V+)
NetC45_2: C45.2 T4.2 U11.2(AC(L))
NetF1_2: F1.2 N1.1 RV4.1

### Library data of the parts
C14 C34 C44 C45 = CAP: Capacitor
C42 C43 = Cap Pol1: Polarized Capacitor (Radial); Published: 8-Jun-2000; LatestRevisionDate: 17-Jul-2002; LatestRevisionNote: Re-released for DXP Platform.; PackageReference: RB7.6-15; Publisher: Altium Limited
D22 = ZENER2: Zener Diode; Manufacturer: Littlefuse; Price: 0.65
F1 = FUSE1: Fuse socket w/ cover; Price: 0.25
L2 = INDUCTOR: Radial type Inductor 2A
N1 = NTC: Thermister
R64 = Res3: Resistor
RV4 = Res Varistor: Varistor (Voltage-Sensitive Resistor); Published: 24-Mar-1999; LatestRevisionDate: 29-May-2009; LatestRevisionNote: IPC-7351 Footprint Added.; PackageVersion: Mar-2003; PackageReference: 6-0805; Publisher: Altium Limited; PackageDescription: Chip Resistor 0805 Case Size; Code_IPC: RESC2012
T4 = Balum UU9.8/UF9.8: Balum
U11 = HIECUBE_AC-DC_24W: HICUBE AC/DC 24W 12V

## Sheet Relays.SchDoc
size A4
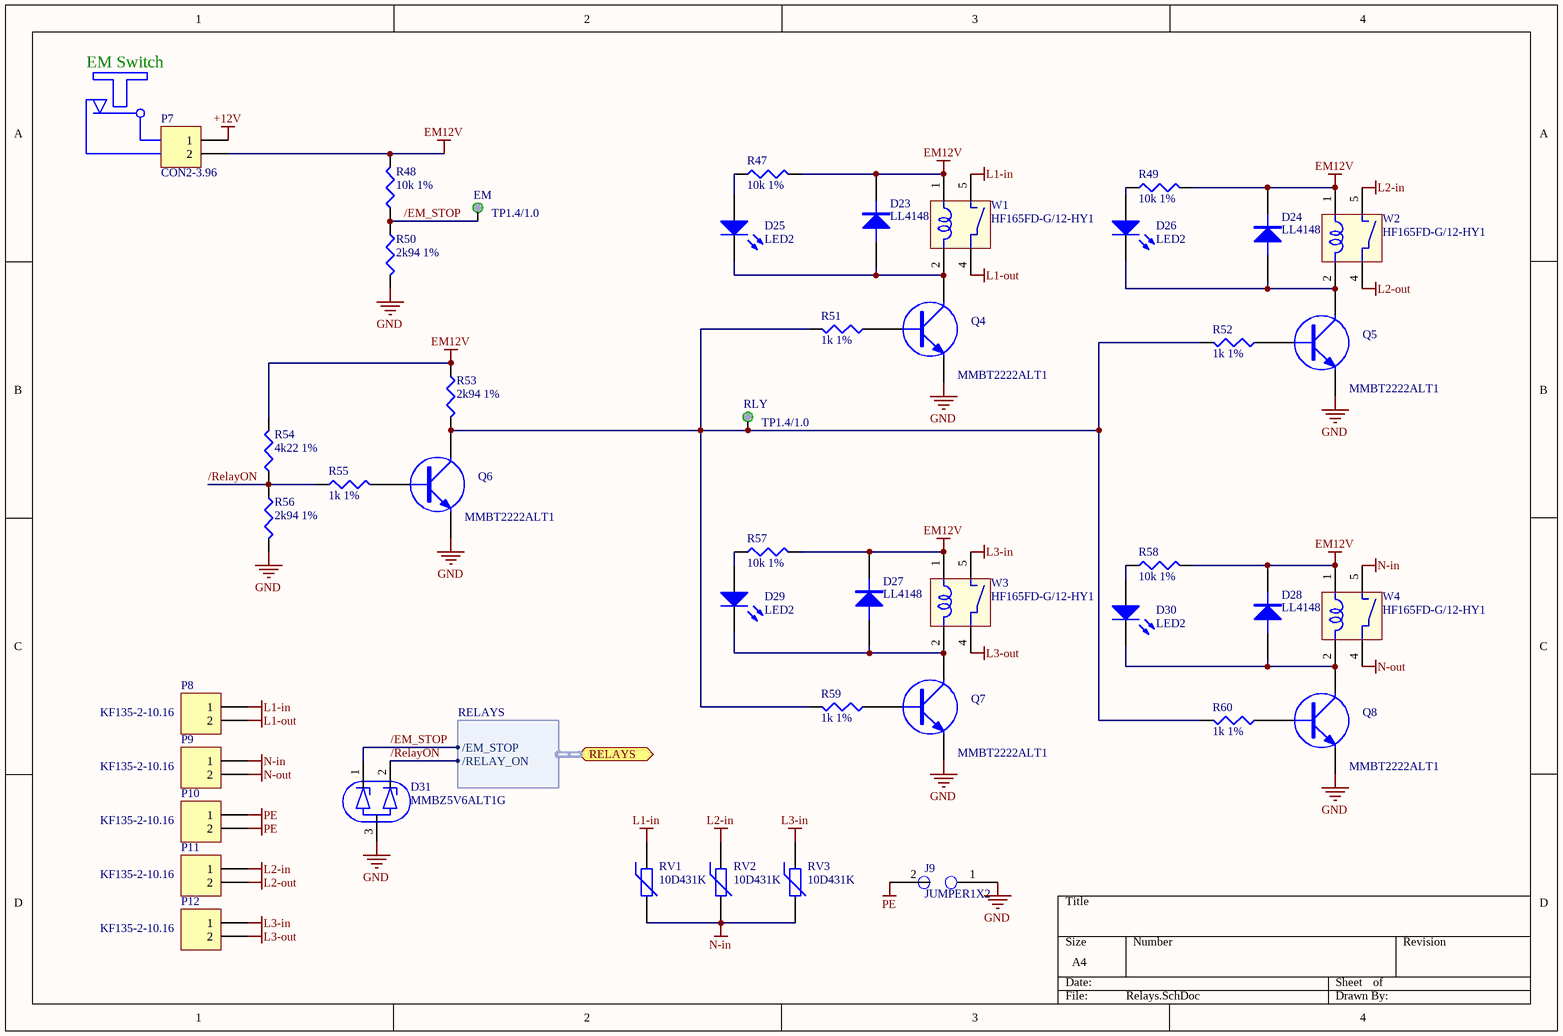
[diagram p14: Relays.SchDoc]

### Parts
D23  LL4148  [MELF-D3513-1405]
D24  LL4148  [MELF-D3513-1405]
D25  LED2  [3.2X1.6X1.1]
D26  LED2  [3.2X1.6X1.1]
D27  LL4148  [MELF-D3513-1405]
D28  LL4148  [MELF-D3513-1405]
D29  LED2  [3.2X1.6X1.1]
D30  LED2  [3.2X1.6X1.1]
D31  MMBZ5V6ALT1G  [SOT23-3N]
EM  TP1.4/1.0  [TP1.4/1.0]  (no BOM)
J9  JUMPER1X2  [JP-SOLDER-H1X2-3X2]  (no BOM)
P7  CON2-3.96  [CON2/3.96mm]
P8  KF135-2-10.16  [KF135-2-10.16]
P9  KF135-2-10.16  [KF135-2-10.16]
P10  KF135-2-10.16  [KF135-2-10.16]
P11  KF135-2-10.16  [KF135-2-10.16]
P12  KF135-2-10.16  [KF135-2-10.16]
Q4  MMBT2222ALT1  [SOT23-3N]
Q5  MMBT2222ALT1  [SOT23-3N]
Q6  MMBT2222ALT1  [SOT23-3N]
Q7  MMBT2222ALT1  [SOT23-3N]
Q8  MMBT2222ALT1  [SOT23-3N]
R47  10k 1%  [RESC2012N]
R48  10k 1%  [RESC2012N]
R49  10k 1%  [RESC2012N]
R50  2k94 1%  [RESC2012N]
R51  1k 1%  [RESC2012N]
R52  1k 1%  [RESC2012N]
R53  2k94 1%  [RESC2012N]
R54  4k22 1%  [RESC2012N]
R55  1k 1%  [RESC2012N]
R56  2k94 1%  [RESC2012N]
R57  10k 1%  [RESC2012N]
R58  10k 1%  [RESC2012N]
R59  1k 1%  [RESC2012N]
R60  1k 1%  [RESC2012N]
RLY  TP1.4/1.0  [TP1.4/1.0]  (no BOM)
RV1  10D431K  [10D431K]
RV2  10D431K  [10D431K]
RV3  10D431K  [10D431K]
W1  HF165FD-G/12-HY1  [HF165FD-G/12-HY1]
W2  HF165FD-G/12-HY1  [HF165FD-G/12-HY1]
W3  HF165FD-G/12-HY1  [HF165FD-G/12-HY1]
W4  HF165FD-G/12-HY1  [HF165FD-G/12-HY1]

### Ports
RELAYS (harness RELAYS)

### Harnesses
RELAYS: /EM_STOP, /RELAY_ON

### Nets
+12V: P7.1
EM12V: D23.2(K) D24.2(K) D27.2(K) D28.2(K) P7.2 R47.2 R48.2 R49.2 R53.1 R54.2 R57.2 R58.2 W1.1 W2.1 W3.1 W4.1
GND: D31.3 J9.1 Q4.2(E) Q5.2(E) Q6.2(E) Q7.2(E) Q8.2(E) R50.2 R56.2
L1-in: P8.1 RV1.1 W1.5
L1-out: P8.2 W1.4
L2-in: P11.1 RV2.1 W2.5
L2-out: P11.2 W2.4
L3-in: P12.1 RV3.1 W3.5
L3-out: P12.2 W3.4
N-in: P9.1 RV1.2 RV2.2 RV3.2 W4.5
N-out: P9.2 W4.4
PE: J9.2 P10.1 P10.2
/EM_STOP: D31.1 EM.1 R48.1 R50.1 ; port RELAYS./EM_STOP
/RelayON: D31.2 R54.1 R55.1 R56.1 ; port RELAYS./RELAY_ON
NetD23_1: D23.1(A) D25.2(K) Q4.3(C) W1.2
NetD24_1: D24.1(A) D26.2(K) Q5.3(C) W2.2
NetD25_1: D25.1(A) R47.1
NetD26_1: D26.1(A) R49.1
NetD27_1: D27.1(A) D29.2(K) Q7.3(C) W3.2
NetD28_1: D28.1(A) D30.2(K) Q8.3(C) W4.2
NetD29_1: D29.1(A) R57.1
NetD30_1: D30.1(A) R58.1
NetQ4_1: Q4.1(B) R51.1
NetQ5_1: Q5.1(B) R52.1
NetQ6_1: Q6.1(B) R55.2
NetQ6_3: Q6.3(C) R51.2 R52.2 R53.2 R59.2 R60.2 RLY.1
NetQ7_1: Q7.1(B) R59.1
NetQ8_1: Q8.1(B) R60.1

### Notes on the sheet
- EM Switch

### Library data of the parts
D23 D24 D27 D28 = DIODE
D25 D26 D29 D30 = LED2: as D14 on sheet LCD_Direct; Published: 8-Jun-2000; LatestRevisionDate: 17-Jul-2002; LatestRevisionNote: Re-released for DXP Platform.; PackageDocument: Feb-2002; PackageReference: 3.2X1.6X1.1; Publisher: Altium Limited
D31 = PESD3V3S2UT: as D1 on sheet MCU; Price: 0.25
P7 = Header 2: Header, 2-Pin; LatestRevisionDate: 17-Jul-2002; LatestRevisionNote: Re-released for DXP Platform.; Publisher: Altium Limited
P8-P12 = Header 2: LatestRevisionDate: 17-Jul-2002; LatestRevisionNote: Re-released for DXP Platform.; Publisher: Altium Limited
Q4-Q8 = NPN: NPN transistor; Price: 0.25
R47-R60 = Res3: Resistor
RV1-RV3 = Res Varistor: Varistor (Voltage-Sensitive Resistor); Published: 24-Mar-1999; LatestRevisionDate: 29-May-2009; LatestRevisionNote: IPC-7351 Footprint Added.; PackageVersion: Mar-2003; PackageReference: 6-0805; Publisher: Altium Limited; PackageDescription: Chip Resistor 0805 Case Size; Code_IPC: RESC2012
W1-W4 = HF165FD-G/12-HY1: Hongfa power relay 40A

## Nets that join several sheets
+3V3: MCU (10 pins), Pilot (R26.2 R30.1), EEP (C1.1 R1.2 R2.2 U1.8), Sockets (6 pins), TempSensor (C37.2 R39.2 U9.3), IR_BEAT (5 pins), RFID (Y8.1), LCD_Direct (5 pins), Power2 (5 pins)
+5V: Sockets (7 pins), Buzzor (C46.1 D13.2 DS1.1), LCD_Direct (R41.1 R42.1 R43.1 R44.1), Power2 (D4.2 J2.2 R10.2 Y1.1)
+12V: Power1 (C24.1 R14.1 R15.1 U5.2), Power2 (C15.1 R8.2 U3.7), AC_DC (5 pins), Relays (P7.1)
+A3V3: MCU (C8.1 U2.13), CT (R20.2 R21.2 R22.2), Power2 (C22.1 Y2.3)
+A12V: Pilot (C32.2 U6.8), Power1 (+A12.1 Y3.3)
-A12V: Pilot (C30.1 U6.4), Power1 (-A12.1 Y4.1)
AGND: MCU (C8.2 D1.3 D2.3 U2.12), CT (9 pins), Power2 (C22.2 J4.2 Y2.2)
GND: MCU (15 pins), Pilot (D10.1), EEP (5 pins), Sockets (6 pins), TempSensor (C37.1 U9.1), IR_BEAT (6 pins), RFID (J10.2), Buzzor (C46.2 Q2.2), LCD_Direct (C40.2 C41.2 D14.2 U10.1), Power1 (C24.2 D8.2 J11.2 U5.1), Power2 (20 pins), AC_DC (5 pins), Relays (9 pins)
GND-A12V: Pilot (5 pins), Power1 (9 pins)
L1-in: AC_DC (F1.1), Relays (P8.1 RV1.1 W1.5)
N-in: AC_DC (C14.1 R64.2 RV4.2 T4.3), Relays (5 pins)
PE: AC_DC (C34.2 C45.1), Relays (J9.2 P10.1 P10.2)
/BLA: MCU (U2.54), LCD_Direct (R46.1)
/CS: MCU (U2.2), LCD_Direct (U10.15)
/EM_STOP: MCU (U2.40), Relays (D31.1 EM.1 R48.1 R50.1)
/RelayON: MCU (U2.39), Relays (D31.2 R54.1 R55.1 R56.1)
/RES: MCU (U2.53), LCD_Direct (U10.14)
/WR: MCU (U2.61), LCD_Direct (U10.12)
CHARGE: MCU (U2.24), LCD_Direct (D18.2)
CT1: MCU (D1.1 U2.8), CT (CT1.1 Y5.3)
CT2: MCU (D1.2 U2.9), CT (CT2.1 Y6.3)
CT3: MCU (D2.1 U2.10), CT (CT3.1 Y7.3)
DB0: MCU (U2.26), LCD_Direct (U10.10)
DB1: MCU (U2.27), LCD_Direct (U10.9)
DB2: MCU (U2.28), LCD_Direct (U10.8)
DB3: MCU (U2.55), LCD_Direct (U10.7)
DB4: MCU (U2.56), LCD_Direct (U10.6)
DB5: MCU (U2.57), LCD_Direct (U10.5)
DB6: MCU (U2.58), LCD_Direct (U10.4)
DB7: MCU (U2.59), LCD_Direct (U10.3)
EEP_SCL: MCU (R7.1), EEP (R1.1 U1.6)
EEP_SDA: MCU (U2.30), EEP (R2.1 U1.5)
EEP_WC: MCU (U2.33), EEP (U1.7)
FAULT: MCU (U2.20), LCD_Direct (D20.2)
NetIR_PULSE_1: MCU (U2.3), IR_BEAT (IR_PULSE.1 U7.1)
NetPWM_1: MCU (U2.41), Pilot (PWM.1 R31.1)
NetR5_1: MCU (R5.1), RFID (U8.3)
NetR36_1: MCU (U2.4), IR_BEAT (R36.1)
NetR39_1: MCU (U2.38), TempSensor (R39.1 TEMP.1 U9.2)
NetR40_2: MCU (U2.50), Buzzor (R40.2)
NetU2_17: MCU (U2.17), RFID (U8.2)
NRST: MCU (C9.1 U2.7), Sockets (P5.20 P6.2)
PILOT: MCU (D2.2 U2.23), Pilot (Pilot.1 R26.1 R27.2 R29.2)
READY: MCU (U2.25), LCD_Direct (D16.2)
RS: MCU (U2.62), LCD_Direct (U10.13)
SWCLK: MCU (U2.49), Sockets (P5.18 P6.4)
SWDIO: MCU (U2.46), Sockets (P5.16 P6.5)
U1_RESET: MCU (U2.37), Sockets (P5.22)
U1_RXD: MCU (U2.52), Sockets (P5.14)
U1_TXD: MCU (R6.2), Sockets (P5.12)
U2-CTS: MCU (U2.44), Sockets (P5.17)
U2-EN: MCU (U2.11), Sockets (P5.11)
U2-RESET: MCU (U2.21), Sockets (P5.23)
U2-RTS: MCU (U2.45), Sockets (P5.19)
U2-RXD: MCU (U2.43), Sockets (P5.15)
U2-SLEEP: MCU (U2.22), Sockets (P5.21)
U2-TXD: MCU (R4.1), Sockets (P5.13)